# Altium schematic sheet as14120_x31_fpga_ddr.SchDoc
size A2; PageSetup: Record=PageOptions|CenterHorizontal=True|CenterVertical=True|PrintScale=0.74|XCorrection=1.00|YCorrection=1.00|PrintKind=1|BorderSize=5000000|LeftOffset=0|BottomOffset=0|Orientation=2|PaperLength=4290|PaperWidth=3060|Scale=100|PaperSource=7|PrintQuality=-4|MediaType=1|DitherType=10|PaperKind=A3 (без полей / бумага продольной резки) (297 x 420 мм)|PrintScaleMode=1
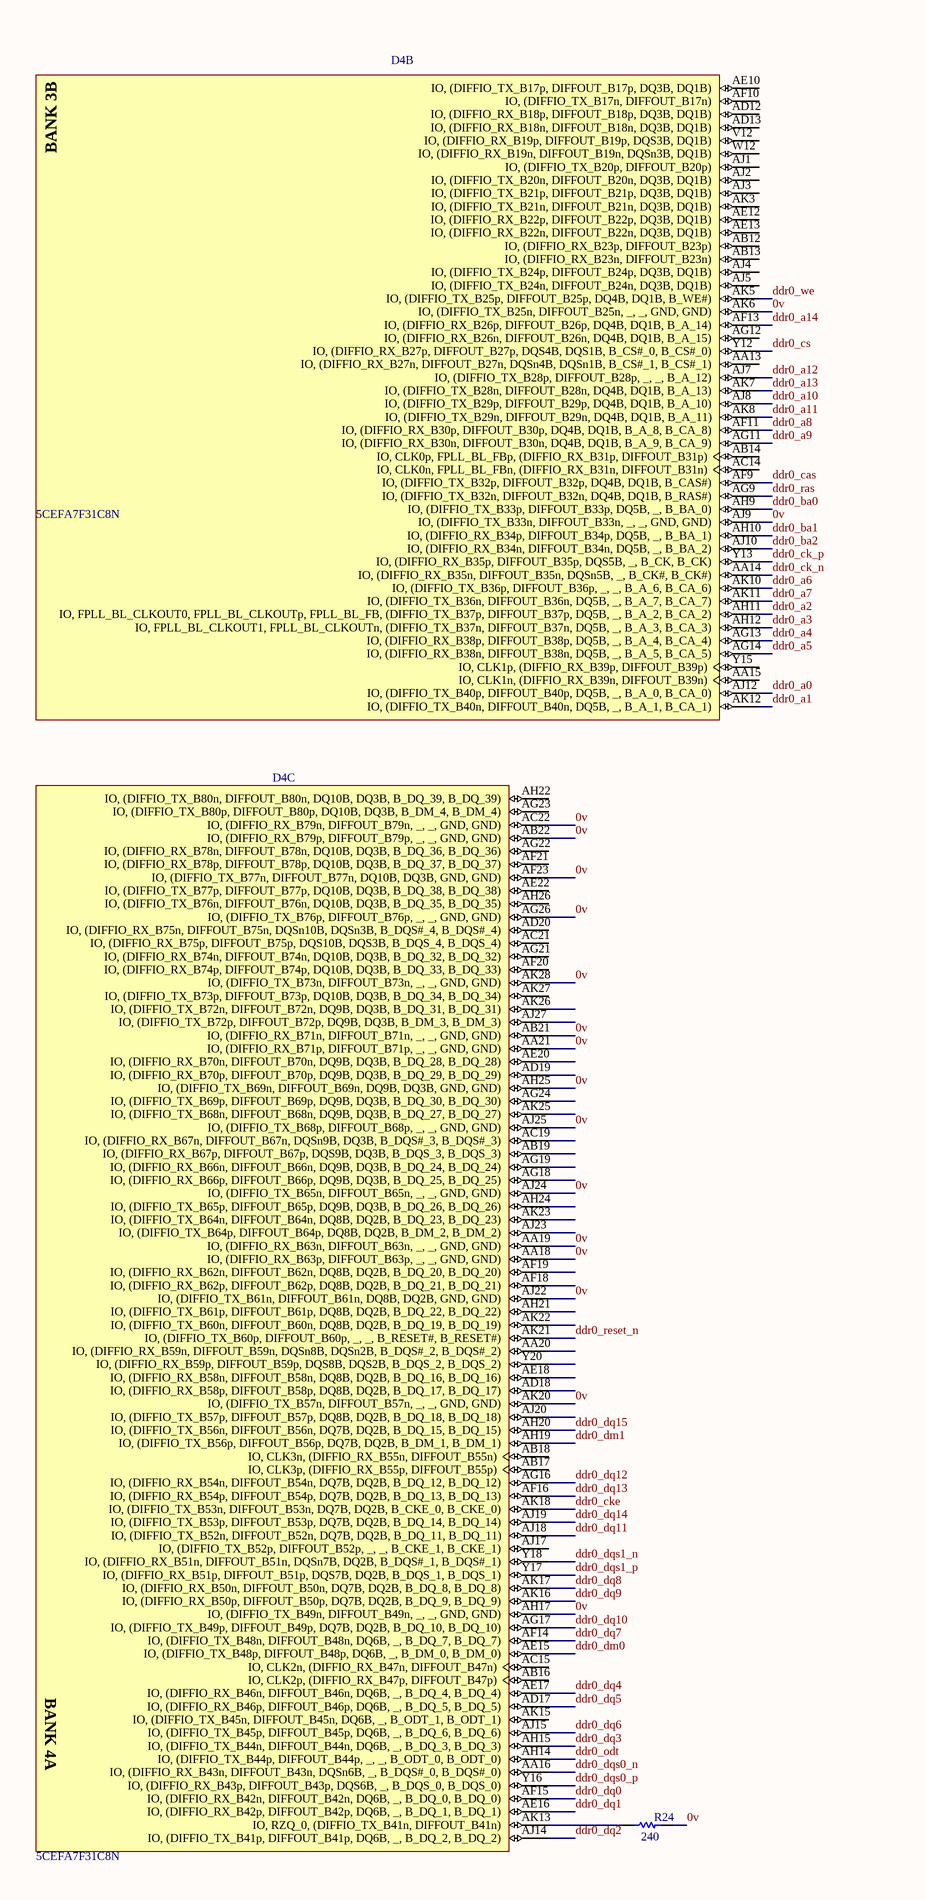
[diagram p0: as14120_x31_fpga_ddr.SchDoc, left]
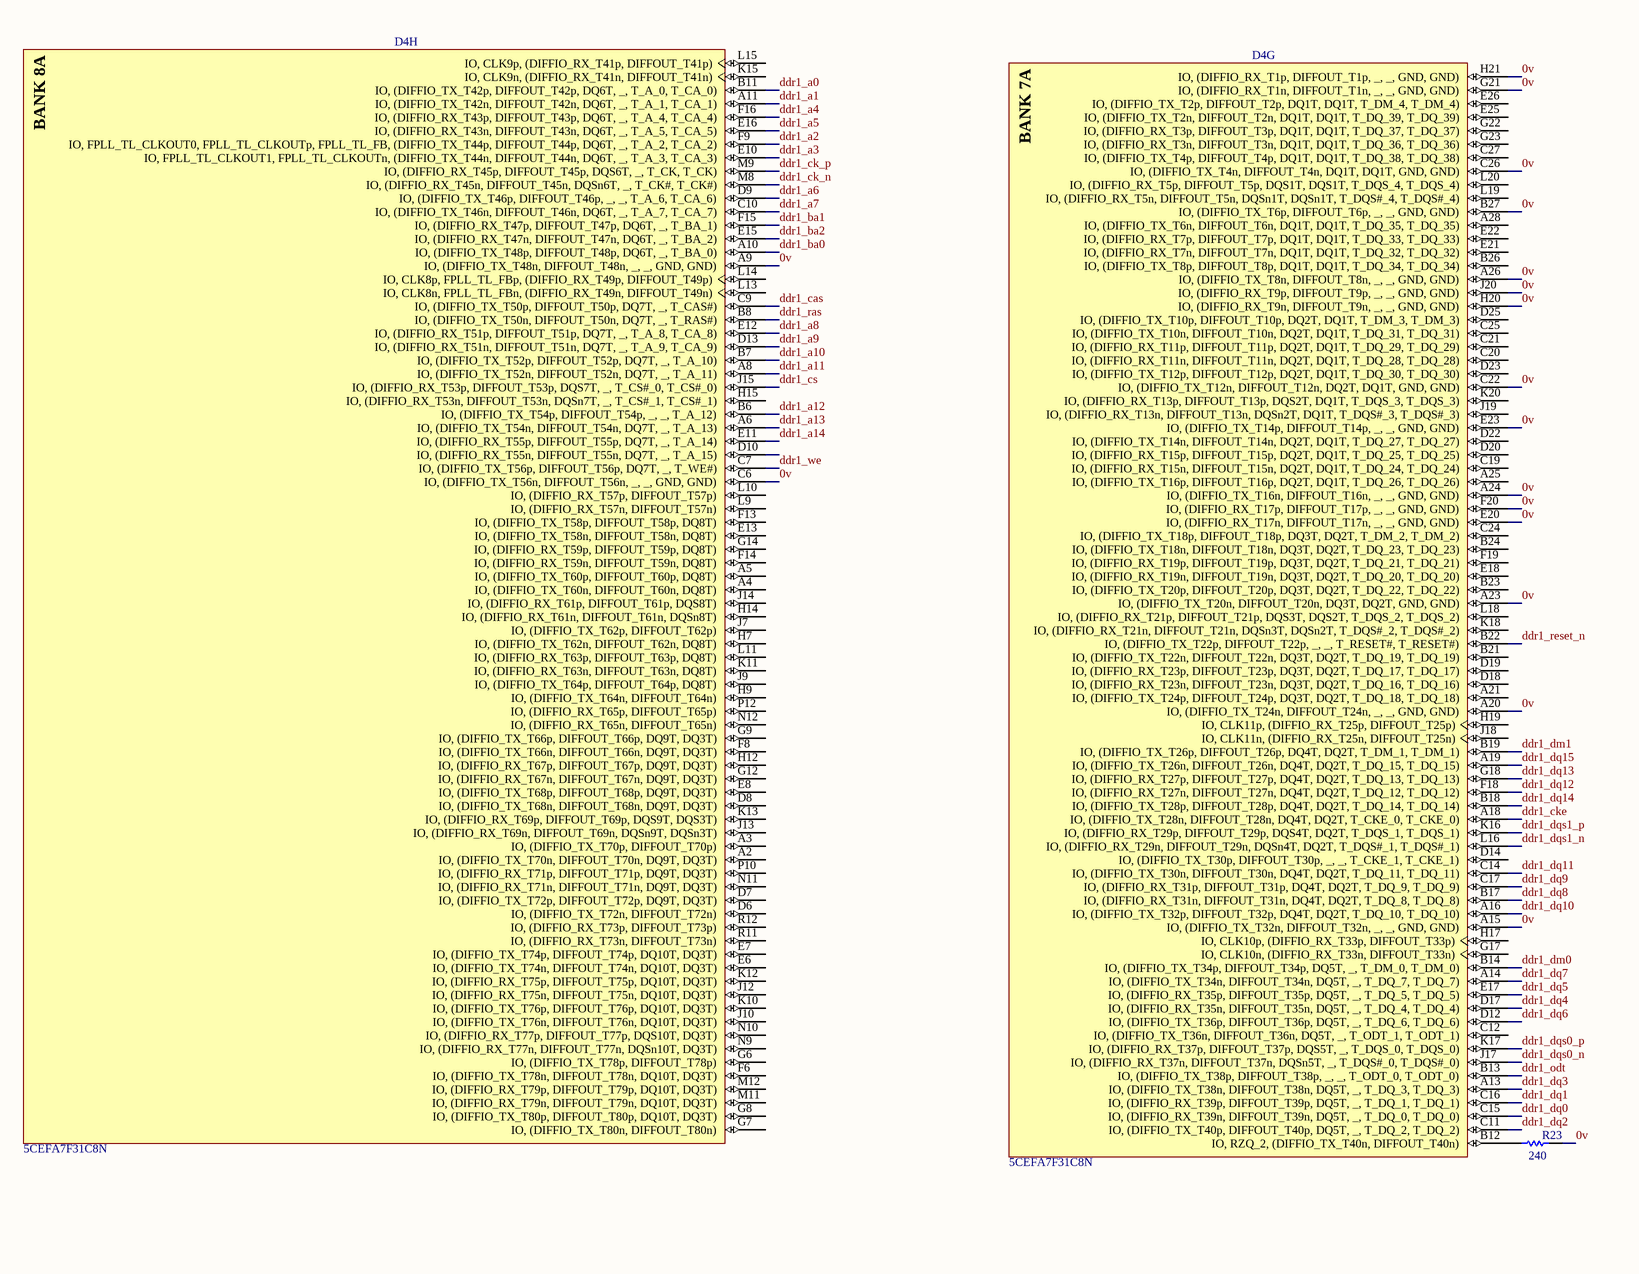
[diagram p1: as14120_x31_fpga_ddr.SchDoc, right]

## Parts
D4  5CEFA7F31C8N  [ALTR-896-FBGA-2000A]  (parts B,C,G,H of 13)
R23  value 240  [RESC0805(2012)_L]  (hidden comment: 1K 1% 0805(2012))
R24  value 240  [RESC0805(2012)_L]  (hidden comment: 1K 1% 0805(2012))

## Nets
0v: D4.A9(IO,_(DIFFIO_TX_T48n,_DIFFOUT_T48n,__,__,_GND,_GND)) D4.A15(IO,_(DIFFIO_TX_T32n,_DIFFOUT_T32n,__,__,_GND,_GND)) D4.A20(IO,_(DIFFIO_TX_T24n,_DIFFOUT_T24n,__,__,_GND,_GND)) D4.A23(IO,_(DIFFIO_TX_T20n,_DIFFOUT_T20n,_DQ3T,_DQ2T,_GND,_GND)) D4.A24(IO,_(DIFFIO_TX_T16n,_DIFFOUT_T16n,__,__,_GND,_GND)) D4.A26(IO,_(DIFFIO_TX_T8n,_DIFFOUT_T8n,__,__,_GND,_GND)) D4.AA18(IO,_(DIFFIO_RX_B63p,_DIFFOUT_B63p,__,__,_GND,_GND)) D4.AA19(IO,_(DIFFIO_RX_B63n,_DIFFOUT_B63n,__,__,_GND,_GND)) D4.AA21(IO,_(DIFFIO_RX_B71p,_DIFFOUT_B71p,__,__,_GND,_GND)) D4.AB21(IO,_(DIFFIO_RX_B71n,_DIFFOUT_B71n,__,__,_GND,_GND)) D4.AB22(IO,_(DIFFIO_RX_B79p,_DIFFOUT_B79p,__,__,_GND,_GND)) D4.AC22(IO,_(DIFFIO_RX_B79n,_DIFFOUT_B79n,__,__,_GND,_GND)) D4.AF23(IO,_(DIFFIO_TX_B77n,_DIFFOUT_B77n,_DQ10B,_DQ3B,_GND,_GND)) D4.AG26(IO,_(DIFFIO_TX_B76p,_DIFFOUT_B76p,__,__,_GND,_GND)) D4.AH17(IO,_(DIFFIO_TX_B49n,_DIFFOUT_B49n,__,__,_GND,_GND)) D4.AH25(IO,_(DIFFIO_TX_B69n,_DIFFOUT_B69n,_DQ9B,_DQ3B,_GND,_GND)) D4.AJ9(IO,_(DIFFIO_TX_B33n,_DIFFOUT_B33n,__,__,_GND,_GND)) D4.AJ22(IO,_(DIFFIO_TX_B61n,_DIFFOUT_B61n,_DQ8B,_DQ2B,_GND,_GND)) D4.AJ24(IO,_(DIFFIO_TX_B65n,_DIFFOUT_B65n,__,__,_GND,_GND)) D4.AJ25(IO,_(DIFFIO_TX_B68p,_DIFFOUT_B68p,__,__,_GND,_GND)) D4.AK6(IO,_(DIFFIO_TX_B25n,_DIFFOUT_B25n,__,__,_GND,_GND)) D4.AK20(IO,_(DIFFIO_TX_B57n,_DIFFOUT_B57n,__,__,_GND,_GND)) D4.AK28(IO,_(DIFFIO_TX_B73n,_DIFFOUT_B73n,__,__,_GND,_GND)) D4.B27(IO,_(DIFFIO_TX_T6p,_DIFFOUT_T6p,__,__,_GND,_GND)) D4.C6(IO,_(DIFFIO_TX_T56n,_DIFFOUT_T56n,__,__,_GND,_GND)) D4.C22(IO,_(DIFFIO_TX_T12n,_DIFFOUT_T12n,_DQ2T,_DQ1T,_GND,_GND)) D4.C26(IO,_(DIFFIO_TX_T4n,_DIFFOUT_T4n,_DQ1T,_DQ1T,_GND,_GND)) D4.E20(IO,_(DIFFIO_RX_T17n,_DIFFOUT_T17n,__,__,_GND,_GND)) D4.E23(IO,_(DIFFIO_TX_T14p,_DIFFOUT_T14p,__,__,_GND,_GND)) D4.F20(IO,_(DIFFIO_RX_T17p,_DIFFOUT_T17p,__,__,_GND,_GND)) D4.G21(IO,_(DIFFIO_RX_T1n,_DIFFOUT_T1n,__,__,_GND,_GND)) D4.H20(IO,_(DIFFIO_RX_T9n,_DIFFOUT_T9n,__,__,_GND,_GND)) D4.H21(IO,_(DIFFIO_RX_T1p,_DIFFOUT_T1p,__,__,_GND,_GND)) D4.J20(IO,_(DIFFIO_RX_T9p,_DIFFOUT_T9p,__,__,_GND,_GND)) R23.2 R24.2
ddr0_a0: D4.AJ12(IO,_(DIFFIO_TX_B40p,_DIFFOUT_B40p,_DQ5B,__,_B_A_0,_B_CA_0))
ddr0_a1: D4.AK12(IO,_(DIFFIO_TX_B40n,_DIFFOUT_B40n,_DQ5B,__,_B_A_1,_B_CA_1))
ddr0_a2: D4.AH11(IO,_FPLL_BL_CLKOUT0,_FPLL_BL_CLKOUTp,_FPLL_BL_FB,_(DIFFIO_TX_B37p,_DIFFOUT_B37p,_DQ5B,__,_B_A_2,_B_CA_2))
ddr0_a3: D4.AH12(IO,_FPLL_BL_CLKOUT1,_FPLL_BL_CLKOUTn,_(DIFFIO_TX_B37n,_DIFFOUT_B37n,_DQ5B,__,_B_A_3,_B_CA_3))
ddr0_a4: D4.AG13(IO,_(DIFFIO_RX_B38p,_DIFFOUT_B38p,_DQ5B,__,_B_A_4,_B_CA_4))
ddr0_a5: D4.AG14(IO,_(DIFFIO_RX_B38n,_DIFFOUT_B38n,_DQ5B,__,_B_A_5,_B_CA_5))
ddr0_a6: D4.AK10(IO,_(DIFFIO_TX_B36p,_DIFFOUT_B36p,__,__,_B_A_6,_B_CA_6))
ddr0_a7: D4.AK11(IO,_(DIFFIO_TX_B36n,_DIFFOUT_B36n,_DQ5B,__,_B_A_7,_B_CA_7))
ddr0_a8: D4.AF11(IO,_(DIFFIO_RX_B30p,_DIFFOUT_B30p,_DQ4B,_DQ1B,_B_A_8,_B_CA_8))
ddr0_a9: D4.AG11(IO,_(DIFFIO_RX_B30n,_DIFFOUT_B30n,_DQ4B,_DQ1B,_B_A_9,_B_CA_9))
ddr0_a10: D4.AJ8(IO,_(DIFFIO_TX_B29p,_DIFFOUT_B29p,_DQ4B,_DQ1B,_B_A_10))
ddr0_a11: D4.AK8(IO,_(DIFFIO_TX_B29n,_DIFFOUT_B29n,_DQ4B,_DQ1B,_B_A_11))
ddr0_a12: D4.AJ7(IO,_(DIFFIO_TX_B28p,_DIFFOUT_B28p,__,__,_B_A_12))
ddr0_a13: D4.AK7(IO,_(DIFFIO_TX_B28n,_DIFFOUT_B28n,_DQ4B,_DQ1B,_B_A_13))
ddr0_a14: D4.AF13(IO,_(DIFFIO_RX_B26p,_DIFFOUT_B26p,_DQ4B,_DQ1B,_B_A_14))
ddr0_ba0: D4.AH9(IO,_(DIFFIO_TX_B33p,_DIFFOUT_B33p,_DQ5B,__,_B_BA_0))
ddr0_ba1: D4.AH10(IO,_(DIFFIO_RX_B34p,_DIFFOUT_B34p,_DQ5B,__,_B_BA_1))
ddr0_ba2: D4.AJ10(IO,_(DIFFIO_RX_B34n,_DIFFOUT_B34n,_DQ5B,__,_B_BA_2))
ddr0_cas: D4.AF9(IO,_(DIFFIO_TX_B32p,_DIFFOUT_B32p,_DQ4B,_DQ1B,_B_CAS#))
ddr0_ck_n: D4.AA14(IO,_(DIFFIO_RX_B35n,_DIFFOUT_B35n,_DQSn5B,__,_B_CK#,_B_CK#))
ddr0_ck_p: D4.Y13(IO,_(DIFFIO_RX_B35p,_DIFFOUT_B35p,_DQS5B,__,_B_CK,_B_CK))
ddr0_cke: D4.AK18(IO,_(DIFFIO_TX_B53n,_DIFFOUT_B53n,_DQ7B,_DQ2B,_B_CKE_0,_B_CKE_0))
ddr0_cs: D4.Y12(IO,_(DIFFIO_RX_B27p,_DIFFOUT_B27p,_DQS4B,_DQS1B,_B_CS#_0,_B_CS#_0))
ddr0_dm0: D4.AE15(IO,_(DIFFIO_TX_B48p,_DIFFOUT_B48p,_DQ6B,__,_B_DM_0,_B_DM_0))
ddr0_dm1: D4.AH19(IO,_(DIFFIO_TX_B56p,_DIFFOUT_B56p,_DQ7B,_DQ2B,_B_DM_1,_B_DM_1))
ddr0_dq0: D4.AF15(IO,_(DIFFIO_RX_B42n,_DIFFOUT_B42n,_DQ6B,__,_B_DQ_0,_B_DQ_0))
ddr0_dq1: D4.AE16(IO,_(DIFFIO_RX_B42p,_DIFFOUT_B42p,_DQ6B,__,_B_DQ_1,_B_DQ_1))
ddr0_dq2: D4.AJ14(IO,_(DIFFIO_TX_B41p,_DIFFOUT_B41p,_DQ6B,__,_B_DQ_2,_B_DQ_2))
ddr0_dq3: D4.AH15(IO,_(DIFFIO_TX_B44n,_DIFFOUT_B44n,_DQ6B,__,_B_DQ_3,_B_DQ_3))
ddr0_dq4: D4.AE17(IO,_(DIFFIO_RX_B46n,_DIFFOUT_B46n,_DQ6B,__,_B_DQ_4,_B_DQ_4))
ddr0_dq5: D4.AD17(IO,_(DIFFIO_RX_B46p,_DIFFOUT_B46p,_DQ6B,__,_B_DQ_5,_B_DQ_5))
ddr0_dq6: D4.AJ15(IO,_(DIFFIO_TX_B45p,_DIFFOUT_B45p,_DQ6B,__,_B_DQ_6,_B_DQ_6))
ddr0_dq7: D4.AF14(IO,_(DIFFIO_TX_B48n,_DIFFOUT_B48n,_DQ6B,__,_B_DQ_7,_B_DQ_7))
ddr0_dq8: D4.AK17(IO,_(DIFFIO_RX_B50n,_DIFFOUT_B50n,_DQ7B,_DQ2B,_B_DQ_8,_B_DQ_8))
ddr0_dq9: D4.AK16(IO,_(DIFFIO_RX_B50p,_DIFFOUT_B50p,_DQ7B,_DQ2B,_B_DQ_9,_B_DQ_9))
ddr0_dq10: D4.AG17(IO,_(DIFFIO_TX_B49p,_DIFFOUT_B49p,_DQ7B,_DQ2B,_B_DQ_10,_B_DQ_10))
ddr0_dq11: D4.AJ18(IO,_(DIFFIO_TX_B52n,_DIFFOUT_B52n,_DQ7B,_DQ2B,_B_DQ_11,_B_DQ_11))
ddr0_dq12: D4.AG16(IO,_(DIFFIO_RX_B54n,_DIFFOUT_B54n,_DQ7B,_DQ2B,_B_DQ_12,_B_DQ_12))
ddr0_dq13: D4.AF16(IO,_(DIFFIO_RX_B54p,_DIFFOUT_B54p,_DQ7B,_DQ2B,_B_DQ_13,_B_DQ_13))
ddr0_dq14: D4.AJ19(IO,_(DIFFIO_TX_B53p,_DIFFOUT_B53p,_DQ7B,_DQ2B,_B_DQ_14,_B_DQ_14))
ddr0_dq15: D4.AH20(IO,_(DIFFIO_TX_B56n,_DIFFOUT_B56n,_DQ7B,_DQ2B,_B_DQ_15,_B_DQ_15))
ddr0_dqs0_n: D4.AA16(IO,_(DIFFIO_RX_B43n,_DIFFOUT_B43n,_DQSn6B,__,_B_DQS#_0,_B_DQS#_0))
ddr0_dqs0_p: D4.Y16(IO,_(DIFFIO_RX_B43p,_DIFFOUT_B43p,_DQS6B,__,_B_DQS_0,_B_DQS_0))
ddr0_dqs1_n: D4.Y18(IO,_(DIFFIO_RX_B51n,_DIFFOUT_B51n,_DQSn7B,_DQ2B,_B_DQS#_1,_B_DQS#_1))
ddr0_dqs1_p: D4.Y17(IO,_(DIFFIO_RX_B51p,_DIFFOUT_B51p,_DQS7B,_DQ2B,_B_DQS_1,_B_DQS_1))
ddr0_odt: D4.AH14(IO,_(DIFFIO_TX_B44p,_DIFFOUT_B44p,__,__,_B_ODT_0,_B_ODT_0))
ddr0_ras: D4.AG9(IO,_(DIFFIO_TX_B32n,_DIFFOUT_B32n,_DQ4B,_DQ1B,_B_RAS#))
ddr0_reset_n: D4.AK21(IO,_(DIFFIO_TX_B60p,_DIFFOUT_B60p,__,__,_B_RESET#,_B_RESET#))
ddr0_we: D4.AK5(IO,_(DIFFIO_TX_B25p,_DIFFOUT_B25p,_DQ4B,_DQ1B,_B_WE#))
ddr1_a0: D4.B11(IO,_(DIFFIO_TX_T42p,_DIFFOUT_T42p,_DQ6T,__,_T_A_0,_T_CA_0))
ddr1_a1: D4.A11(IO,_(DIFFIO_TX_T42n,_DIFFOUT_T42n,_DQ6T,__,_T_A_1,_T_CA_1))
ddr1_a2: D4.F9(IO,_FPLL_TL_CLKOUT0,_FPLL_TL_CLKOUTp,_FPLL_TL_FB,_(DIFFIO_TX_T44p,_DIFFOUT_T44p,_DQ6T,__,_T_A_2,_T_CA_2))
ddr1_a3: D4.E10(IO,_FPLL_TL_CLKOUT1,_FPLL_TL_CLKOUTn,_(DIFFIO_TX_T44n,_DIFFOUT_T44n,_DQ6T,__,_T_A_3,_T_CA_3))
ddr1_a4: D4.F16(IO,_(DIFFIO_RX_T43p,_DIFFOUT_T43p,_DQ6T,__,_T_A_4,_T_CA_4))
ddr1_a5: D4.E16(IO,_(DIFFIO_RX_T43n,_DIFFOUT_T43n,_DQ6T,__,_T_A_5,_T_CA_5))
ddr1_a6: D4.D9(IO,_(DIFFIO_TX_T46p,_DIFFOUT_T46p,__,__,_T_A_6,_T_CA_6))
ddr1_a7: D4.C10(IO,_(DIFFIO_TX_T46n,_DIFFOUT_T46n,_DQ6T,__,_T_A_7,_T_CA_7))
ddr1_a8: D4.E12(IO,_(DIFFIO_RX_T51p,_DIFFOUT_T51p,_DQ7T,__,_T_A_8,_T_CA_8))
ddr1_a9: D4.D13(IO,_(DIFFIO_RX_T51n,_DIFFOUT_T51n,_DQ7T,__,_T_A_9,_T_CA_9))
ddr1_a10: D4.B7(IO,_(DIFFIO_TX_T52p,_DIFFOUT_T52p,_DQ7T,__,_T_A_10))
ddr1_a11: D4.A8(IO,_(DIFFIO_TX_T52n,_DIFFOUT_T52n,_DQ7T,__,_T_A_11))
ddr1_a12: D4.B6(IO,_(DIFFIO_TX_T54p,_DIFFOUT_T54p,__,__,_T_A_12))
ddr1_a13: D4.A6(IO,_(DIFFIO_TX_T54n,_DIFFOUT_T54n,_DQ7T,__,_T_A_13))
ddr1_a14: D4.E11(IO,_(DIFFIO_RX_T55p,_DIFFOUT_T55p,_DQ7T,__,_T_A_14))
ddr1_ba0: D4.A10(IO,_(DIFFIO_TX_T48p,_DIFFOUT_T48p,_DQ6T,__,_T_BA_0))
ddr1_ba1: D4.F15(IO,_(DIFFIO_RX_T47p,_DIFFOUT_T47p,_DQ6T,__,_T_BA_1))
ddr1_ba2: D4.E15(IO,_(DIFFIO_RX_T47n,_DIFFOUT_T47n,_DQ6T,__,_T_BA_2))
ddr1_cas: D4.C9(IO,_(DIFFIO_TX_T50p,_DIFFOUT_T50p,_DQ7T,__,_T_CAS#))
ddr1_ck_n: D4.M8(IO,_(DIFFIO_RX_T45n,_DIFFOUT_T45n,_DQSn6T,__,_T_CK#,_T_CK#))
ddr1_ck_p: D4.M9(IO,_(DIFFIO_RX_T45p,_DIFFOUT_T45p,_DQS6T,__,_T_CK,_T_CK))
ddr1_cke: D4.A18(IO,_(DIFFIO_TX_T28n,_DIFFOUT_T28n,_DQ4T,_DQ2T,_T_CKE_0,_T_CKE_0))
ddr1_cs: D4.J15(IO,_(DIFFIO_RX_T53p,_DIFFOUT_T53p,_DQS7T,__,_T_CS#_0,_T_CS#_0))
ddr1_dm0: D4.B14(IO,_(DIFFIO_TX_T34p,_DIFFOUT_T34p,_DQ5T,__,_T_DM_0,_T_DM_0))
ddr1_dm1: D4.B19(IO,_(DIFFIO_TX_T26p,_DIFFOUT_T26p,_DQ4T,_DQ2T,_T_DM_1,_T_DM_1))
ddr1_dq0: D4.C15(IO,_(DIFFIO_RX_T39n,_DIFFOUT_T39n,_DQ5T,__,_T_DQ_0,_T_DQ_0))
ddr1_dq1: D4.C16(IO,_(DIFFIO_RX_T39p,_DIFFOUT_T39p,_DQ5T,__,_T_DQ_1,_T_DQ_1))
ddr1_dq2: D4.C11(IO,_(DIFFIO_TX_T40p,_DIFFOUT_T40p,_DQ5T,__,_T_DQ_2,_T_DQ_2))
ddr1_dq3: D4.A13(IO,_(DIFFIO_TX_T38n,_DIFFOUT_T38n,_DQ5T,__,_T_DQ_3,_T_DQ_3))
ddr1_dq4: D4.D17(IO,_(DIFFIO_RX_T35n,_DIFFOUT_T35n,_DQ5T,__,_T_DQ_4,_T_DQ_4))
ddr1_dq5: D4.E17(IO,_(DIFFIO_RX_T35p,_DIFFOUT_T35p,_DQ5T,__,_T_DQ_5,_T_DQ_5))
ddr1_dq6: D4.D12(IO,_(DIFFIO_TX_T36p,_DIFFOUT_T36p,_DQ5T,__,_T_DQ_6,_T_DQ_6))
ddr1_dq7: D4.A14(IO,_(DIFFIO_TX_T34n,_DIFFOUT_T34n,_DQ5T,__,_T_DQ_7,_T_DQ_7))
ddr1_dq8: D4.B17(IO,_(DIFFIO_RX_T31n,_DIFFOUT_T31n,_DQ4T,_DQ2T,_T_DQ_8,_T_DQ_8))
ddr1_dq9: D4.C17(IO,_(DIFFIO_RX_T31p,_DIFFOUT_T31p,_DQ4T,_DQ2T,_T_DQ_9,_T_DQ_9))
ddr1_dq10: D4.A16(IO,_(DIFFIO_TX_T32p,_DIFFOUT_T32p,_DQ4T,_DQ2T,_T_DQ_10,_T_DQ_10))
ddr1_dq11: D4.C14(IO,_(DIFFIO_TX_T30n,_DIFFOUT_T30n,_DQ4T,_DQ2T,_T_DQ_11,_T_DQ_11))
ddr1_dq12: D4.F18(IO,_(DIFFIO_RX_T27n,_DIFFOUT_T27n,_DQ4T,_DQ2T,_T_DQ_12,_T_DQ_12))
ddr1_dq13: D4.G18(IO,_(DIFFIO_RX_T27p,_DIFFOUT_T27p,_DQ4T,_DQ2T,_T_DQ_13,_T_DQ_13))
ddr1_dq14: D4.B18(IO,_(DIFFIO_TX_T28p,_DIFFOUT_T28p,_DQ4T,_DQ2T,_T_DQ_14,_T_DQ_14))
ddr1_dq15: D4.A19(IO,_(DIFFIO_TX_T26n,_DIFFOUT_T26n,_DQ4T,_DQ2T,_T_DQ_15,_T_DQ_15))
ddr1_dqs0_n: D4.J17(IO,_(DIFFIO_RX_T37n,_DIFFOUT_T37n,_DQSn5T,__,_T_DQS#_0,_T_DQS#_0))
ddr1_dqs0_p: D4.K17(IO,_(DIFFIO_RX_T37p,_DIFFOUT_T37p,_DQS5T,__,_T_DQS_0,_T_DQS_0))
ddr1_dqs1_n: D4.L16(IO,_(DIFFIO_RX_T29n,_DIFFOUT_T29n,_DQSn4T,_DQ2T,_T_DQS#_1,_T_DQS#_1))
ddr1_dqs1_p: D4.K16(IO,_(DIFFIO_RX_T29p,_DIFFOUT_T29p,_DQS4T,_DQ2T,_T_DQS_1,_T_DQS_1))
ddr1_odt: D4.B13(IO,_(DIFFIO_TX_T38p,_DIFFOUT_T38p,__,__,_T_ODT_0,_T_ODT_0))
ddr1_ras: D4.B8(IO,_(DIFFIO_TX_T50n,_DIFFOUT_T50n,_DQ7T,__,_T_RAS#))
ddr1_reset_n: D4.B22(IO,_(DIFFIO_TX_T22p,_DIFFOUT_T22p,__,__,_T_RESET#,_T_RESET#))
ddr1_we: D4.C7(IO,_(DIFFIO_TX_T56p,_DIFFOUT_T56p,_DQ7T,__,_T_WE#))
NetD4_AK13: D4.AK13(IO,_RZQ_0,_(DIFFIO_TX_B41n,_DIFFOUT_B41n)) R24.1
NetD4_B12: D4.B12(IO,_RZQ_2,_(DIFFIO_TX_T40n,_DIFFOUT_T40n)) R23.1

Not connected (* = marked no-connect by the designer): D4 A2(IO,_(DIFFIO_TX_T70n,_DIFFOUT_T70n,_DQ9T,_DQ3T)) A3(IO,_(DIFFIO_TX_T70p,_DIFFOUT_T70p)) A4(IO,_(DIFFIO_TX_T60n,_DIFFOUT_T60n,_DQ8T)) A5(IO,_(DIFFIO_TX_T60p,_DIFFOUT_T60p,_DQ8T)) A21(IO,_(DIFFIO_TX_T24p,_DIFFOUT_T24p,_DQ3T,_DQ2T,_T_DQ_18,_T_DQ_18)) A25(IO,_(DIFFIO_TX_T16p,_DIFFOUT_T16p,_DQ2T,_DQ1T,_T_DQ_26,_T_DQ_26)) A28(IO,_(DIFFIO_TX_T6n,_DIFFOUT_T6n,_DQ1T,_DQ1T,_T_DQ_35,_T_DQ_35)) AA13(IO,_(DIFFIO_RX_B27n,_DIFFOUT_B27n,_DQSn4B,_DQSn1B,_B_CS#_1,_B_CS#_1)) AA15(IO,_CLK1n,_(DIFFIO_RX_B39n,_DIFFOUT_B39n)) AA20(IO,_(DIFFIO_RX_B59n,_DIFFOUT_B59n,_DQSn8B,_DQSn2B,_B_DQS#_2,_B_DQS#_2)) AB12(IO,_(DIFFIO_RX_B23p,_DIFFOUT_B23p)) AB13(IO,_(DIFFIO_RX_B23n,_DIFFOUT_B23n)) AB14(IO,_CLK0p,_FPLL_BL_FBp,_(DIFFIO_RX_B31p,_DIFFOUT_B31p)) AB16(IO,_CLK2p,_(DIFFIO_RX_B47p,_DIFFOUT_B47p)) AB17(IO,_CLK3p,_(DIFFIO_RX_B55p,_DIFFOUT_B55p)) AB18(IO,_CLK3n,_(DIFFIO_RX_B55n,_DIFFOUT_B55n)) AB19(IO,_(DIFFIO_RX_B67p,_DIFFOUT_B67p,_DQS9B,_DQ3B,_B_DQS_3,_B_DQS_3)) AC14(IO,_CLK0n,_FPLL_BL_FBn,_(DIFFIO_RX_B31n,_DIFFOUT_B31n)) AC15(IO,_CLK2n,_(DIFFIO_RX_B47n,_DIFFOUT_B47n)) AC19(IO,_(DIFFIO_RX_B67n,_DIFFOUT_B67n,_DQSn9B,_DQ3B,_B_DQS#_3,_B_DQS#_3)) AC21(IO,_(DIFFIO_RX_B75p,_DIFFOUT_B75p,_DQS10B,_DQS3B,_B_DQS_4,_B_DQS_4)) AD12(IO,_(DIFFIO_RX_B18p,_DIFFOUT_B18p,_DQ3B,_DQ1B)) AD13(IO,_(DIFFIO_RX_B18n,_DIFFOUT_B18n,_DQ3B,_DQ1B)) AD18(IO,_(DIFFIO_RX_B58p,_DIFFOUT_B58p,_DQ8B,_DQ2B,_B_DQ_17,_B_DQ_17)) AD19(IO,_(DIFFIO_RX_B70p,_DIFFOUT_B70p,_DQ9B,_DQ3B,_B_DQ_29,_B_DQ_29)) AD20(IO,_(DIFFIO_RX_B75n,_DIFFOUT_B75n,_DQSn10B,_DQSn3B,_B_DQS#_4,_B_DQS#_4)) AE10(IO,_(DIFFIO_TX_B17p,_DIFFOUT_B17p,_DQ3B,_DQ1B)) AE12(IO,_(DIFFIO_RX_B22p,_DIFFOUT_B22p,_DQ3B,_DQ1B)) AE13(IO,_(DIFFIO_RX_B22n,_DIFFOUT_B22n,_DQ3B,_DQ1B)) AE18(IO,_(DIFFIO_RX_B58n,_DIFFOUT_B58n,_DQ8B,_DQ2B,_B_DQ_16,_B_DQ_16)) AE20(IO,_(DIFFIO_RX_B70n,_DIFFOUT_B70n,_DQ9B,_DQ3B,_B_DQ_28,_B_DQ_28)) AE22(IO,_(DIFFIO_TX_B77p,_DIFFOUT_B77p,_DQ10B,_DQ3B,_B_DQ_38,_B_DQ_38)) AF10(IO,_(DIFFIO_TX_B17n,_DIFFOUT_B17n)) AF18(IO,_(DIFFIO_RX_B62p,_DIFFOUT_B62p,_DQ8B,_DQ2B,_B_DQ_21,_B_DQ_21)) AF19(IO,_(DIFFIO_RX_B62n,_DIFFOUT_B62n,_DQ8B,_DQ2B,_B_DQ_20,_B_DQ_20)) AF20(IO,_(DIFFIO_RX_B74p,_DIFFOUT_B74p,_DQ10B,_DQ3B,_B_DQ_33,_B_DQ_33)) AF21(IO,_(DIFFIO_RX_B78p,_DIFFOUT_B78p,_DQ10B,_DQ3B,_B_DQ_37,_B_DQ_37)) AG12(IO,_(DIFFIO_RX_B26n,_DIFFOUT_B26n,_DQ4B,_DQ1B,_B_A_15)) AG18(IO,_(DIFFIO_RX_B66p,_DIFFOUT_B66p,_DQ9B,_DQ3B,_B_DQ_25,_B_DQ_25)) AG19(IO,_(DIFFIO_RX_B66n,_DIFFOUT_B66n,_DQ9B,_DQ3B,_B_DQ_24,_B_DQ_24)) AG21(IO,_(DIFFIO_RX_B74n,_DIFFOUT_B74n,_DQ10B,_DQ3B,_B_DQ_32,_B_DQ_32)) AG22(IO,_(DIFFIO_RX_B78n,_DIFFOUT_B78n,_DQ10B,_DQ3B,_B_DQ_36,_B_DQ_36)) AG23(IO,_(DIFFIO_TX_B80p,_DIFFOUT_B80p,_DQ10B,_DQ3B,_B_DM_4,_B_DM_4)) AG24(IO,_(DIFFIO_TX_B69p,_DIFFOUT_B69p,_DQ9B,_DQ3B,_B_DQ_30,_B_DQ_30)) AH21(IO,_(DIFFIO_TX_B61p,_DIFFOUT_B61p,_DQ8B,_DQ2B,_B_DQ_22,_B_DQ_22)) AH22(IO,_(DIFFIO_TX_B80n,_DIFFOUT_B80n,_DQ10B,_DQ3B,_B_DQ_39,_B_DQ_39)) AH24(IO,_(DIFFIO_TX_B65p,_DIFFOUT_B65p,_DQ9B,_DQ3B,_B_DQ_26,_B_DQ_26)) AH26(IO,_(DIFFIO_TX_B76n,_DIFFOUT_B76n,_DQ10B,_DQ3B,_B_DQ_35,_B_DQ_35)) AJ1(IO,_(DIFFIO_TX_B20p,_DIFFOUT_B20p)) AJ2(IO,_(DIFFIO_TX_B20n,_DIFFOUT_B20n,_DQ3B,_DQ1B)) AJ3(IO,_(DIFFIO_TX_B21p,_DIFFOUT_B21p,_DQ3B,_DQ1B)) AJ4(IO,_(DIFFIO_TX_B24p,_DIFFOUT_B24p,_DQ3B,_DQ1B)) AJ5(IO,_(DIFFIO_TX_B24n,_DIFFOUT_B24n,_DQ3B,_DQ1B)) AJ17(IO,_(DIFFIO_TX_B52p,_DIFFOUT_B52p,__,__,_B_CKE_1,_B_CKE_1)) AJ20(IO,_(DIFFIO_TX_B57p,_DIFFOUT_B57p,_DQ8B,_DQ2B,_B_DQ_18,_B_DQ_18)) AJ23(IO,_(DIFFIO_TX_B64p,_DIFFOUT_B64p,_DQ8B,_DQ2B,_B_DM_2,_B_DM_2)) AJ27(IO,_(DIFFIO_TX_B72p,_DIFFOUT_B72p,_DQ9B,_DQ3B,_B_DM_3,_B_DM_3)) AK3(IO,_(DIFFIO_TX_B21n,_DIFFOUT_B21n,_DQ3B,_DQ1B)) AK15(IO,_(DIFFIO_TX_B45n,_DIFFOUT_B45n,_DQ6B,__,_B_ODT_1,_B_ODT_1)) AK22(IO,_(DIFFIO_TX_B60n,_DIFFOUT_B60n,_DQ8B,_DQ2B,_B_DQ_19,_B_DQ_19)) AK23(IO,_(DIFFIO_TX_B64n,_DIFFOUT_B64n,_DQ8B,_DQ2B,_B_DQ_23,_B_DQ_23)) AK25(IO,_(DIFFIO_TX_B68n,_DIFFOUT_B68n,_DQ9B,_DQ3B,_B_DQ_27,_B_DQ_27)) AK26(IO,_(DIFFIO_TX_B72n,_DIFFOUT_B72n,_DQ9B,_DQ3B,_B_DQ_31,_B_DQ_31)) AK27(IO,_(DIFFIO_TX_B73p,_DIFFOUT_B73p,_DQ10B,_DQ3B,_B_DQ_34,_B_DQ_34)) B21(IO,_(DIFFIO_TX_T22n,_DIFFOUT_T22n,_DQ3T,_DQ2T,_T_DQ_19,_T_DQ_19)) B23(IO,_(DIFFIO_TX_T20p,_DIFFOUT_T20p,_DQ3T,_DQ2T,_T_DQ_22,_T_DQ_22)) B24(IO,_(DIFFIO_TX_T18n,_DIFFOUT_T18n,_DQ3T,_DQ2T,_T_DQ_23,_T_DQ_23)) B26(IO,_(DIFFIO_TX_T8p,_DIFFOUT_T8p,_DQ1T,_DQ1T,_T_DQ_34,_T_DQ_34)) C12(IO,_(DIFFIO_TX_T36n,_DIFFOUT_T36n,_DQ5T,__,_T_ODT_1,_T_ODT_1)) C19(IO,_(DIFFIO_RX_T15n,_DIFFOUT_T15n,_DQ2T,_DQ1T,_T_DQ_24,_T_DQ_24)) C20(IO,_(DIFFIO_RX_T11n,_DIFFOUT_T11n,_DQ2T,_DQ1T,_T_DQ_28,_T_DQ_28)) C21(IO,_(DIFFIO_RX_T11p,_DIFFOUT_T11p,_DQ2T,_DQ1T,_T_DQ_29,_T_DQ_29)) C24(IO,_(DIFFIO_TX_T18p,_DIFFOUT_T18p,_DQ3T,_DQ2T,_T_DM_2,_T_DM_2)) C25(IO,_(DIFFIO_TX_T10n,_DIFFOUT_T10n,_DQ2T,_DQ1T,_T_DQ_31,_T_DQ_31)) C27(IO,_(DIFFIO_TX_T4p,_DIFFOUT_T4p,_DQ1T,_DQ1T,_T_DQ_38,_T_DQ_38)) D6(IO,_(DIFFIO_TX_T72n,_DIFFOUT_T72n)) D7(IO,_(DIFFIO_TX_T72p,_DIFFOUT_T72p,_DQ9T,_DQ3T)) D8(IO,_(DIFFIO_TX_T68n,_DIFFOUT_T68n,_DQ9T,_DQ3T)) D10(IO,_(DIFFIO_RX_T55n,_DIFFOUT_T55n,_DQ7T,__,_T_A_15)) D14(IO,_(DIFFIO_TX_T30p,_DIFFOUT_T30p,__,__,_T_CKE_1,_T_CKE_1)) D18(IO,_(DIFFIO_RX_T23n,_DIFFOUT_T23n,_DQ3T,_DQ2T,_T_DQ_16,_T_DQ_16)) D19(IO,_(DIFFIO_RX_T23p,_DIFFOUT_T23p,_DQ3T,_DQ2T,_T_DQ_17,_T_DQ_17)) D20(IO,_(DIFFIO_RX_T15p,_DIFFOUT_T15p,_DQ2T,_DQ1T,_T_DQ_25,_T_DQ_25)) D22(IO,_(DIFFIO_TX_T14n,_DIFFOUT_T14n,_DQ2T,_DQ1T,_T_DQ_27,_T_DQ_27)) D23(IO,_(DIFFIO_TX_T12p,_DIFFOUT_T12p,_DQ2T,_DQ1T,_T_DQ_30,_T_DQ_30)) D25(IO,_(DIFFIO_TX_T10p,_DIFFOUT_T10p,_DQ2T,_DQ1T,_T_DM_3,_T_DM_3)) E6(IO,_(DIFFIO_TX_T74n,_DIFFOUT_T74n,_DQ10T,_DQ3T)) E7(IO,_(DIFFIO_TX_T74p,_DIFFOUT_T74p,_DQ10T,_DQ3T)) E8(IO,_(DIFFIO_TX_T68p,_DIFFOUT_T68p,_DQ9T,_DQ3T)) E13(IO,_(DIFFIO_TX_T58n,_DIFFOUT_T58n,_DQ8T)) E18(IO,_(DIFFIO_RX_T19n,_DIFFOUT_T19n,_DQ3T,_DQ2T,_T_DQ_20,_T_DQ_20)) E21(IO,_(DIFFIO_RX_T7n,_DIFFOUT_T7n,_DQ1T,_DQ1T,_T_DQ_32,_T_DQ_32)) E22(IO,_(DIFFIO_RX_T7p,_DIFFOUT_T7p,_DQ1T,_DQ1T,_T_DQ_33,_T_DQ_33)) E25(IO,_(DIFFIO_TX_T2n,_DIFFOUT_T2n,_DQ1T,_DQ1T,_T_DQ_39,_T_DQ_39)) E26(IO,_(DIFFIO_TX_T2p,_DIFFOUT_T2p,_DQ1T,_DQ1T,_T_DM_4,_T_DM_4)) F6(IO,_(DIFFIO_TX_T78n,_DIFFOUT_T78n,_DQ10T,_DQ3T)) F8(IO,_(DIFFIO_TX_T66n,_DIFFOUT_T66n,_DQ9T,_DQ3T)) F13(IO,_(DIFFIO_TX_T58p,_DIFFOUT_T58p,_DQ8T)) F14(IO,_(DIFFIO_RX_T59n,_DIFFOUT_T59n,_DQ8T)) F19(IO,_(DIFFIO_RX_T19p,_DIFFOUT_T19p,_DQ3T,_DQ2T,_T_DQ_21,_T_DQ_21)) G6(IO,_(DIFFIO_TX_T78p,_DIFFOUT_T78p)) G7(IO,_(DIFFIO_TX_T80n,_DIFFOUT_T80n)) G8(IO,_(DIFFIO_TX_T80p,_DIFFOUT_T80p,_DQ10T,_DQ3T)) G9(IO,_(DIFFIO_TX_T66p,_DIFFOUT_T66p,_DQ9T,_DQ3T)) G12(IO,_(DIFFIO_RX_T67n,_DIFFOUT_T67n,_DQ9T,_DQ3T)) G14(IO,_(DIFFIO_RX_T59p,_DIFFOUT_T59p,_DQ8T)) G17(IO,_CLK10n,_(DIFFIO_RX_T33n,_DIFFOUT_T33n)) G22(IO,_(DIFFIO_RX_T3p,_DIFFOUT_T3p,_DQ1T,_DQ1T,_T_DQ_37,_T_DQ_37)) G23(IO,_(DIFFIO_RX_T3n,_DIFFOUT_T3n,_DQ1T,_DQ1T,_T_DQ_36,_T_DQ_36)) H7(IO,_(DIFFIO_TX_T62n,_DIFFOUT_T62n,_DQ8T)) H9(IO,_(DIFFIO_TX_T64n,_DIFFOUT_T64n)) H12(IO,_(DIFFIO_RX_T67p,_DIFFOUT_T67p,_DQ9T,_DQ3T)) H14(IO,_(DIFFIO_RX_T61n,_DIFFOUT_T61n,_DQSn8T)) H15(IO,_(DIFFIO_RX_T53n,_DIFFOUT_T53n,_DQSn7T,__,_T_CS#_1,_T_CS#_1)) H17(IO,_CLK10p,_(DIFFIO_RX_T33p,_DIFFOUT_T33p)) H19(IO,_CLK11p,_(DIFFIO_RX_T25p,_DIFFOUT_T25p)) J7(IO,_(DIFFIO_TX_T62p,_DIFFOUT_T62p)) J9(IO,_(DIFFIO_TX_T64p,_DIFFOUT_T64p,_DQ8T)) J10(IO,_(DIFFIO_TX_T76n,_DIFFOUT_T76n,_DQ10T,_DQ3T)) J12(IO,_(DIFFIO_RX_T75n,_DIFFOUT_T75n,_DQ10T,_DQ3T)) J13(IO,_(DIFFIO_RX_T69n,_DIFFOUT_T69n,_DQSn9T,_DQSn3T)) J14(IO,_(DIFFIO_RX_T61p,_DIFFOUT_T61p,_DQS8T)) J18(IO,_CLK11n,_(DIFFIO_RX_T25n,_DIFFOUT_T25n)) J19(IO,_(DIFFIO_RX_T13n,_DIFFOUT_T13n,_DQSn2T,_DQ1T,_T_DQS#_3,_T_DQS#_3)) K10(IO,_(DIFFIO_TX_T76p,_DIFFOUT_T76p,_DQ10T,_DQ3T)) K11(IO,_(DIFFIO_RX_T63n,_DIFFOUT_T63n,_DQ8T)) K12(IO,_(DIFFIO_RX_T75p,_DIFFOUT_T75p,_DQ10T,_DQ3T)) K13(IO,_(DIFFIO_RX_T69p,_DIFFOUT_T69p,_DQS9T,_DQS3T)) K15(IO,_CLK9n,_(DIFFIO_RX_T41n,_DIFFOUT_T41n)) K18(IO,_(DIFFIO_RX_T21n,_DIFFOUT_T21n,_DQSn3T,_DQSn2T,_T_DQS#_2,_T_DQS#_2)) K20(IO,_(DIFFIO_RX_T13p,_DIFFOUT_T13p,_DQS2T,_DQ1T,_T_DQS_3,_T_DQS_3)) L9(IO,_(DIFFIO_RX_T57n,_DIFFOUT_T57n)) L10(IO,_(DIFFIO_RX_T57p,_DIFFOUT_T57p)) L11(IO,_(DIFFIO_RX_T63p,_DIFFOUT_T63p,_DQ8T)) L13(IO,_CLK8n,_FPLL_TL_FBn,_(DIFFIO_RX_T49n,_DIFFOUT_T49n)) L14(IO,_CLK8p,_FPLL_TL_FBp,_(DIFFIO_RX_T49p,_DIFFOUT_T49p)) L15(IO,_CLK9p,_(DIFFIO_RX_T41p,_DIFFOUT_T41p)) L18(IO,_(DIFFIO_RX_T21p,_DIFFOUT_T21p,_DQS3T,_DQS2T,_T_DQS_2,_T_DQS_2)) L19(IO,_(DIFFIO_RX_T5n,_DIFFOUT_T5n,_DQSn1T,_DQSn1T,_T_DQS#_4,_T_DQS#_4)) L20(IO,_(DIFFIO_RX_T5p,_DIFFOUT_T5p,_DQS1T,_DQS1T,_T_DQS_4,_T_DQS_4)) M11(IO,_(DIFFIO_RX_T79n,_DIFFOUT_T79n,_DQ10T,_DQ3T)) M12(IO,_(DIFFIO_RX_T79p,_DIFFOUT_T79p,_DQ10T,_DQ3T)) N9(IO,_(DIFFIO_RX_T77n,_DIFFOUT_T77n,_DQSn10T,_DQ3T)) N10(IO,_(DIFFIO_RX_T77p,_DIFFOUT_T77p,_DQS10T,_DQ3T)) N11(IO,_(DIFFIO_RX_T71n,_DIFFOUT_T71n,_DQ9T,_DQ3T)) N12(IO,_(DIFFIO_RX_T65n,_DIFFOUT_T65n)) P10(IO,_(DIFFIO_RX_T71p,_DIFFOUT_T71p,_DQ9T,_DQ3T)) P12(IO,_(DIFFIO_RX_T65p,_DIFFOUT_T65p)) R11(IO,_(DIFFIO_RX_T73n,_DIFFOUT_T73n)) R12(IO,_(DIFFIO_RX_T73p,_DIFFOUT_T73p)) V12(IO,_(DIFFIO_RX_B19p,_DIFFOUT_B19p,_DQS3B,_DQ1B)) W12(IO,_(DIFFIO_RX_B19n,_DIFFOUT_B19n,_DQSn3B,_DQ1B)) Y15(IO,_CLK1p,_(DIFFIO_RX_B39p,_DIFFOUT_B39p)) Y20(IO,_(DIFFIO_RX_B59p,_DIFFOUT_B59p,_DQS8B,_DQS2B,_B_DQS_2,_B_DQS_2))

## Notes on the sheet
- Title
- Size:
- Date:
- File:
- A2
- Number:
- Time:
- Revision:
- Sheet
- of
- (in symbol 5CEFA7F31C8N, part B) BANK 3B
- (in symbol 5CEFA7F31C8N, part C) BANK 4A
- (in symbol 5CEFA7F31C8N, part G) BANK 7A
- (in symbol 5CEFA7F31C8N, part H) BANK 8A

## Library data of the parts
D4 = 5CEFA7F31C8N: Cyclone V E Family FPGA, 1.07 to 1.13 V Supply, 480 I/O Pins, 7 PLLs, 896-Pin FBGA, Speed Grade 8, Commercial Grade, RoHS Compliant; Manufacturer: Altera; Device Group: 5CEFA7; GPIO: 480; Logic Elements (LE) (K): 149.5; Speed Grade: 8; DatasheetVersion: Rev. 3.1; PackageReference: 896-FBGA-2000A; PackageDescription: 896-Pin FineLine Ball-Grid Array (FBGA), Body 31 x 31 mm, Pitch 1 mm; Supplier 1: Digi-Key; Supplier Part Number 1: 544-2768-ND; Supplier 2: Mouser; Supplier Part Number 2: 989-5CEFA7F31C8N; RoHS: RoHS Compliant; Subcategory: Cyclone V E; Voltage Supply: 1.07 to 1.13 V; Mounting Technology: Surface Mount; Code_JEDEC: MS-034-AAN-1; PartNumber: 5CEFA7F31C8N; ComponentLink1Description: Manufacturer URL; ComponentLink1URL: http://www.altera.com; ComponentLink2Description: Datasheet; ComponentLink2URL: http://www.altera.com/literature/hb/cyclone-v/cv_51002.pdf; ComponentLink3Description: Package Specification; ComponentLink3URL: http://www.altera.com/devicepackaging/04R00435-01.pdf; ComponentLink4Description: Device Handbook URL; ComponentLink4URL: http://www.altera.com/literature/hb/cyclone-v/cyclone5_handbook.pdf; ComponentLink5Description: Device Overview URL; ComponentLink5URL: http://www.altera.com/literature/hb/cyclone-v/cv_51001.pdf; ComponentLink6Description: Device Pin-Out URL; ComponentLink6URL: http://www.altera.com/literature/dp/cyclone-v/1.1.txt; ComponentLink7Description: Product URL; ComponentLink7URL: http://www.buyaltera.com/scripts/partsearch.dll?Detail&name=5CEFA7F31C8N-ND
R23 R24 = RES_0805: 1K 0.125W 1% 0805 (2012 Metric)  SMD; Case-Metric: 2012; Case-EIA: 0805; Tolerance: 1 %; Power: 0.125 W; Technology: SMT